# Altium schematic sheet Transport Layer Security.SchDoc
size A4; SheetNumber: 14; SheetTotal: 18
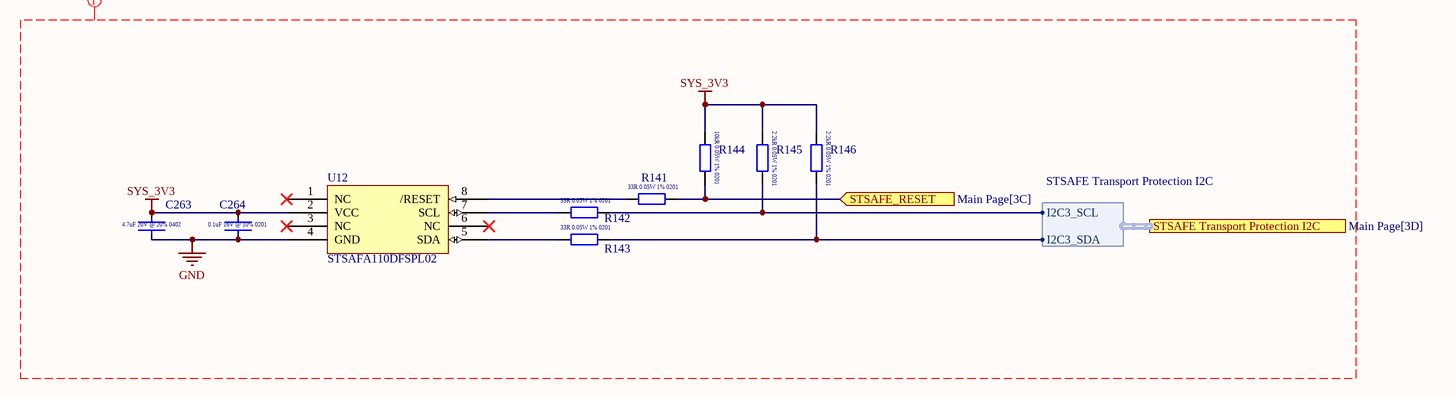
[diagram p0: Transport Layer Security.SchDoc]

## Parts
C263  4.7uF  [CAPC1005X06L]  (value not drawn)
C264  0.1uF  [CAPC0603X03L]  (value not drawn)
R141  ERJ-1GNF33R0C  [RESC0603X03L]  (value not drawn)
R142  ERJ-1GNF33R0C  [RESC0603X03L]  (value not drawn)
R143  ERJ-1GNF33R0C  [RESC0603X03L]  (value not drawn)
R144  ERJ-1GNF1002C  [RESC0603X03L]  (value not drawn)
R145  RC0201FR-072K2L  [RESC0603X03L]  (value not drawn)
R146  RC0201FR-072K2L  [RESC0603X03L]  (value not drawn)
U12  STSAFA110DFSPL02  [STSAFE-A110]

## Ports
STSAFE Transport Protection I2C (harness STSAFE Transport Protection I2C, see Main Page[3D]), STSAFE_RESET (in, see Main Page[3C])

## Harnesses
STSAFE Transport Protection I2C: I2C3_SCL, I2C3_SDA

## Nets
GND: C263.1 C264.1 U12.4(GND)
SYS_3V3: C263.2 C264.2 R144.1 R145.1 R146.1 U12.2(VCC)
STSAFE_RESET: R141.2 R144.2 ; port STSAFE_RESET
NetR141_1: R141.1 U12.8(/RESET)
NetR142_1: R142.1 U12.7(SCL)
NetR142_2: R142.2 R145.2 ; port STSAFE Transport Protection I2C.I2C3_SCL
NetR143_1: R143.1 U12.5(SDA)
NetR143_2: R143.2 R146.2 ; port STSAFE Transport Protection I2C.I2C3_SDA

Not connected (* = marked no-connect by the designer): U12 1(NC)* 3(NC)* 6(NC)*

## Layout directives
net class STSAFE: GND, SYS_3V3

## Notes on the sheet
- (in symbol CL05A475MO5NUNC) 4.7uF 20V @ 20% 0402
- (in symbol ERJ-1GNF33R0C) 33R 0.05W 1% 0201
- (in symbol ERJ-1GNF1002C) 10kR 0.05W 1% 0201
- (in symbol GRM033R61E104KE14J) 0.1uF 16V @ 10% 0201
- (in symbol RC0201FR-072K2L) 2.2kR 0.05W 1% 0201

## Library data of the parts
C263 = CL05A475MO5NUNC: 4.7 µF ±20% 16V Ceramic Capacitor X5R 0402 (1005 Metric)
C264 = GRM033R61E104KE14J: 0.1 µF ±10% 25V Ceramic Capacitor X5R 0201 (0603 Metric)0.1 µF ±10% 25V Ceramic Capacitor X5R 0201 (0603 Metric); ComponentLink1Description: New link; ComponentLink1URL: https://www.digikey.com.au/en/products/detail/murata-electronics/GRM033R61E104KE14J/4904732?s=N4IgTCBcDaIOICUCyAGAzGhA2AjAURxQBYBpAogKRAF0BfIA
R141-R143 = ERJ-1GNF33R0C: 33 Ohms ±1% 0.05W, 1/20W Chip Resistor 0201 (0603 Metric) Thick Film; ComponentLink1Description: New link; ComponentLink1URL: https://www.digikey.com.au/en/products/detail/panasonic-electronic-components/ERJ-1GNF33R0C/2035941
R144 = ERJ-1GNF1002C: 10 kOhms ±1% 0.05W, 1/20W Chip Resistor 0201 (0603 Metric) Thick Film; ComponentLink1Description: New link; ComponentLink1URL: https://www.digikey.com.au/en/products/detail/panasonic-electronic-components/ERJ-1GNF1002C/2036226
R145 R146 = RC0201FR-072K2L: 2.2 kOhms ±1% 0.05W, 1/20W Chip Resistor 0201 (0603 Metric) Moisture Resistant Thick Film
U12 = STSAFA110DFSPL02: Authentication Chip, IoT Secure Element 8-UFDFPN (2x3); ComponentLink1Description: New link; ComponentLink1URL: https://www.digikey.com.au/en/products/detail/stmicroelectronics/STSAFA110DFSPL02/13180776